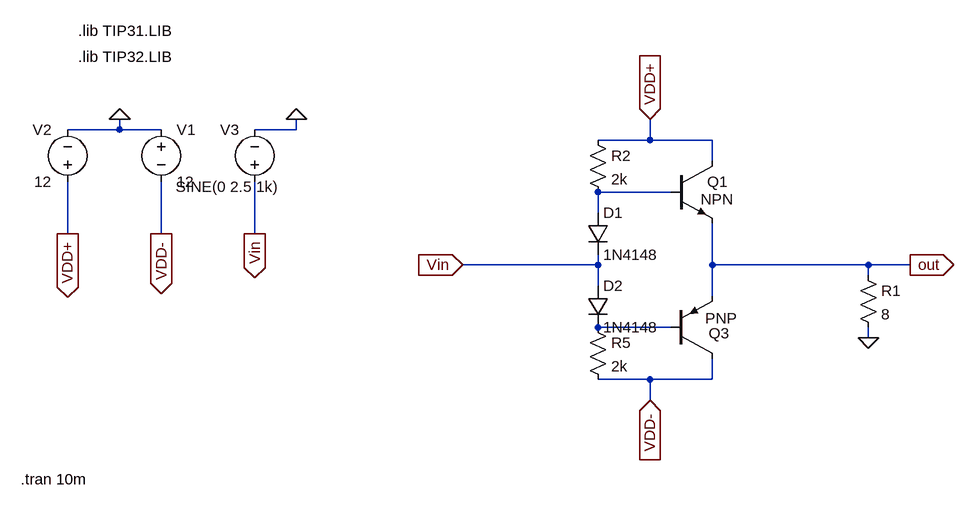
[diagram p0: schematic EW2_project1_power_amp_1.asc]
EW2_project1_power_amp_1.asc, the LTspice schematic file:
Version 4
SHEET 1 1540 1176
WIRE -256 -16 -256 -32
WIRE -256 -16 -336 -16
WIRE -192 -16 -256 -16
WIRE 16 -16 16 -32
WIRE 16 -16 -48 -16
WIRE 560 0 560 -32
WIRE 560 0 480 0
WIRE 656 0 560 0
WIRE 656 32 656 0
WIRE 592 80 480 80
WIRE 480 112 480 80
WIRE -336 144 -336 64
WIRE -192 144 -192 64
WIRE -48 144 -48 64
WIRE 480 192 480 176
WIRE 480 192 272 192
WIRE 656 192 656 128
WIRE 896 192 656 192
WIRE 960 192 896 192
WIRE 896 208 896 192
WIRE 480 224 480 192
WIRE 656 240 656 192
WIRE 592 288 480 288
WIRE 896 304 896 288
WIRE 560 368 480 368
WIRE 656 368 656 336
WIRE 656 368 560 368
WIRE 560 400 560 368
FLAG -256 -32 0
FLAG -336 144 VDD+
IOPIN -336 144 Out
FLAG -192 144 VDD-
IOPIN -192 144 Out
FLAG 960 192 out
IOPIN 960 192 Out
FLAG 560 -32 VDD+
IOPIN 560 -32 In
FLAG 272 192 Vin
IOPIN 272 192 In
FLAG 16 -32 0
FLAG -48 144 Vin
IOPIN -48 144 Out
FLAG 896 304 0
FLAG 560 400 VDD-
IOPIN 560 400 In
SYMBOL npn 592 32 R0
WINDOW 3 46 59 Left 2
SYMATTR InstName Q1
SYMATTR Prefix Qtip31
SYMBOL voltage -192 -32 R0
WINDOW 123 0 0 Left 0
WINDOW 39 0 0 Left 0
SYMATTR InstName V1
SYMATTR Value 12
SYMBOL voltage -336 80 R180
WINDOW 0 24 96 Left 2
WINDOW 3 24 16 Left 2
WINDOW 123 0 0 Left 0
WINDOW 39 0 0 Left 0
SYMATTR InstName V2
SYMATTR Value 12
SYMBOL res 880 192 R0
SYMATTR InstName R1
SYMATTR Value 8
SYMBOL res 464 -16 R0
SYMATTR InstName R2
SYMATTR Value 2k
SYMBOL res 464 272 R0
SYMATTR InstName R5
SYMATTR Value 2k
SYMBOL voltage -48 80 R180
WINDOW 0 24 96 Left 2
WINDOW 3 -37 8 Left 2
WINDOW 123 0 0 Left 0
WINDOW 39 0 0 Left 0
SYMATTR InstName V3
SYMATTR Value SINE(0 2.5 1k)
SYMBOL diode 464 112 R0
SYMATTR InstName D1
SYMATTR Value 1N4148
SYMBOL diode 464 224 R0
SYMATTR InstName D2
SYMATTR Value 1N4148
SYMBOL pnp 592 336 M180
WINDOW 0 58 39 Left 2
WINDOW 3 53 62 Left 2
SYMATTR InstName Q3
SYMATTR Prefix Qtip32
TEXT -320 -168 Left 2 !.lib TIP31.LIB
TEXT -320 -128 Left 2 !.lib TIP32.LIB
TEXT -408 522 Left 2 !.tran 10m

The netlist it stands for:
* EW2_project1_power_amp_1.asc
Q1 VDD+ N001 out 0 NPN
V1 0 VDD- 12
V2 VDD+ 0 12
R1 out 0 8
R2 VDD+ N001 2k
R5 N002 VDD- 2k
V3 Vin 0 SINE(0 2.5 1k)
D1 N001 Vin 1N4148
D2 Vin N002 1N4148
Q3 VDD- N002 out 0 PNP
.model D D
.lib standard.dio
.model NPN NPN
.model PNP PNP
.lib standard.bjt
.lib TIP31.LIB
.lib TIP32.LIB
.tran 10m
.backanno
.end